# EAGLE design schematic (EAGLE 9.6.2)
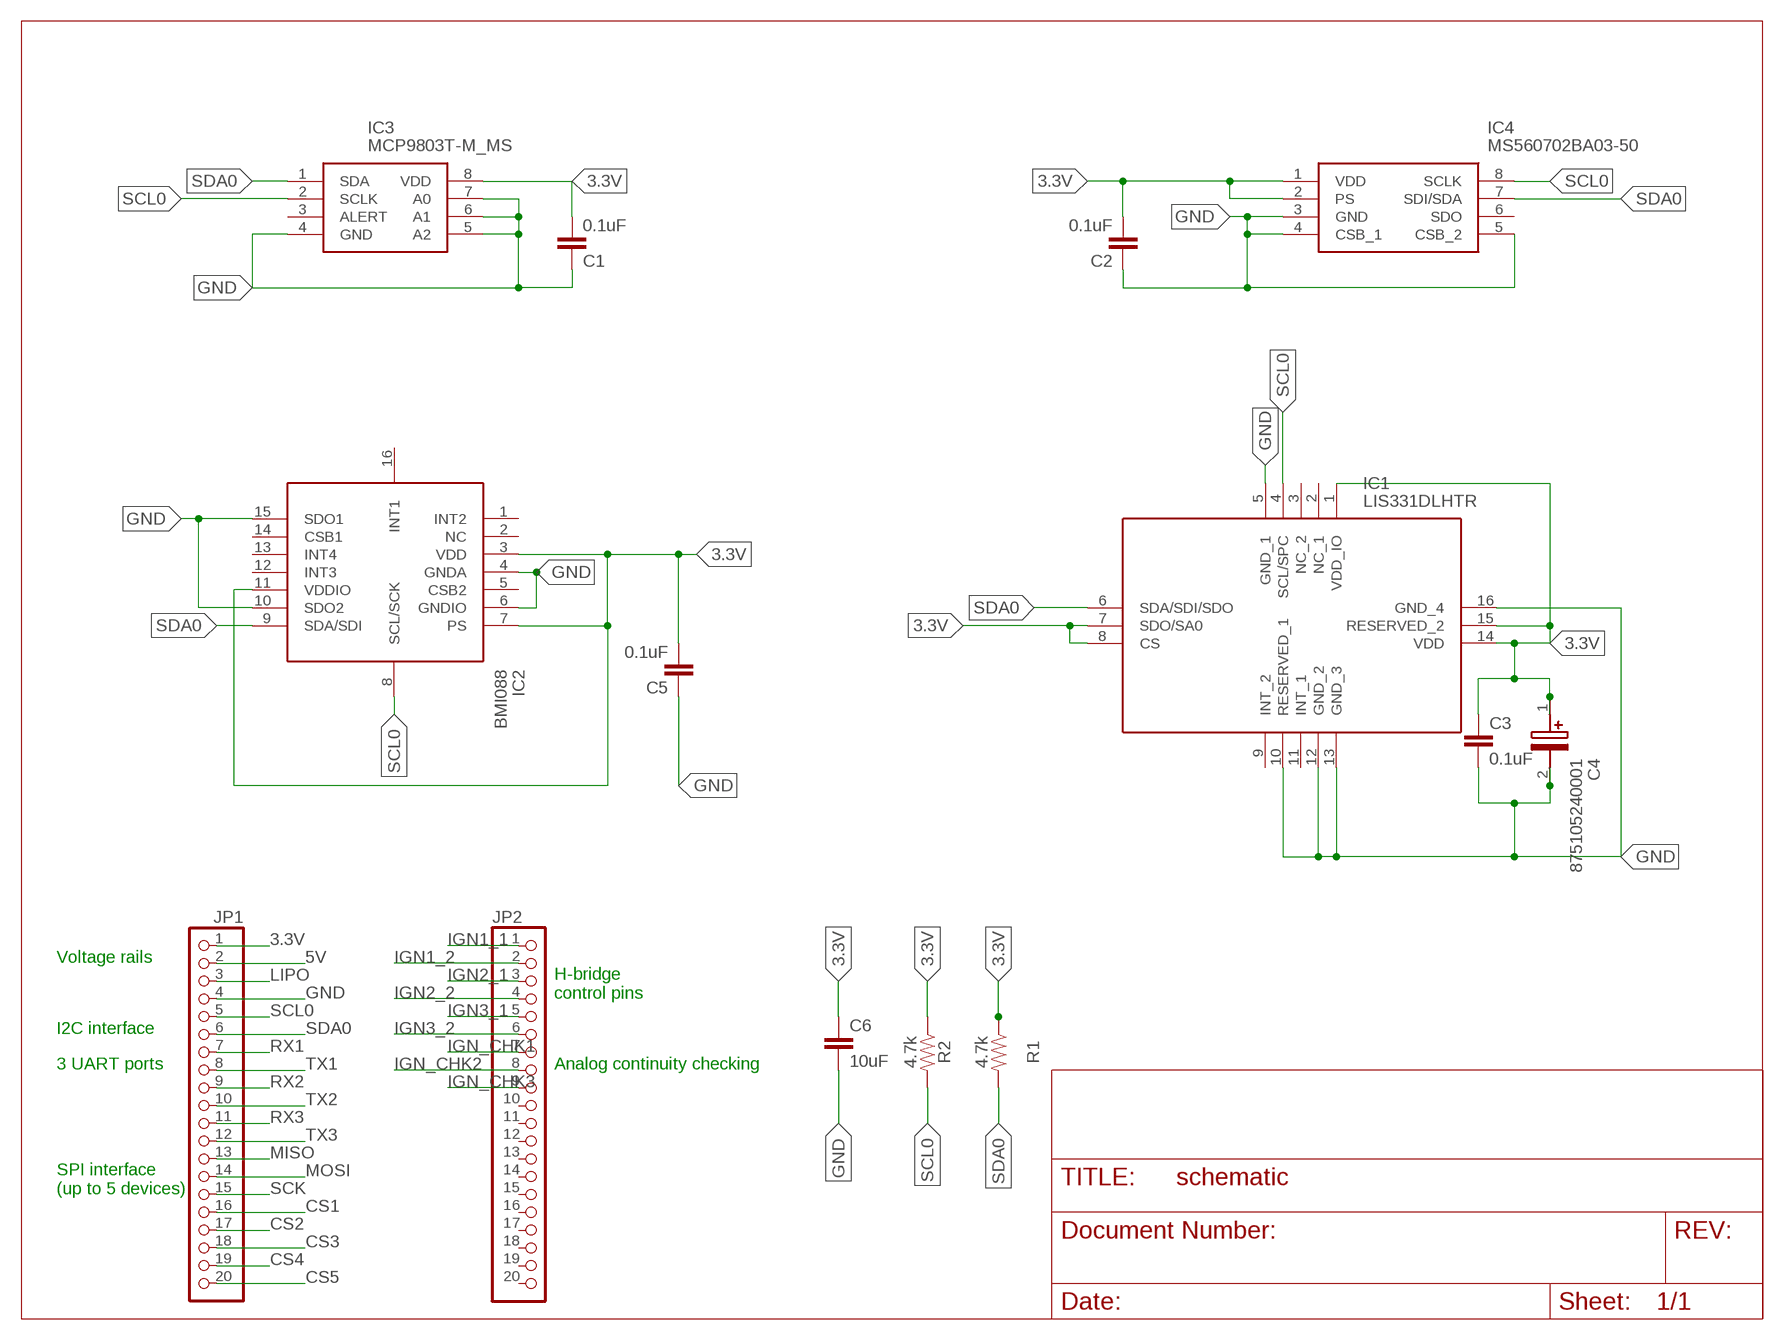
[diagram p0: schematic, sheet 1]

## Parts
C1  0.1uF  CAP-0805  [0805]
C2  0.1uF  CAP-0805  [0805]
C3  0.1uF  CAP-0805  [0805]
C4  875105240001  [CAPAE430X550N]
C5  0.1uF  CAP-0805  [0805]
C6  10uF  10UF-0805-10V-10%  [0805]
IC1  LIS331DLHTR  [LIS331DLHTR]
IC2  BMI088  [BMI088]
IC3  MCP9803T-M_MS  [SOP65P490X110-8N]
IC4  MS560702BA03-50  [MS5607-02BA03]
JP1  PINHD-1X20  [1X20]
JP2  PINHD-1X20  [1X20]
R1  4.7k  RESISTOR0805  [0805]
R2  4.7k  RESISTOR0805  [0805]

## Nets
3.3V: C1.2 C2.2 C3.2 C4.1(+) C5.2 C6.1 IC1.1(VDD_IO) IC1.7(SDO/SA0) IC1.8(CS) IC1.14(VDD) IC1.15(RESERVED_2) IC2.3(VDD) IC2.7(PS) IC2.11(VDDIO) IC3.8(VDD) IC4.1(VDD) IC4.2(PS) JP1.1 R1.1 R2.1
5V: JP1.2
CS1: JP1.16
CS2: JP1.17
CS3: JP1.18
CS4: JP1.19
CS5: JP1.20
GND: C1.1 C2.1 C3.1 C4.2(-) C5.1 C6.2 IC1.5(GND_1) IC1.10(RESERVED_1) IC1.12(GND_2) IC1.13(GND_3) IC1.16(GND_4) IC2.4(GNDA) IC2.6(GNDIO) IC2.10(SDO2) IC2.15(SDO1) IC3.4(GND) IC3.5(A2) IC3.6(A1) IC3.7(A0) IC4.3(GND) IC4.4(CSB_1) IC4.5(CSB_2) JP1.4
IGN1_1: JP2.1
IGN1_2: JP2.2
IGN2_1: JP2.3
IGN2_2: JP2.4
IGN3_1: JP2.5
IGN3_2: JP2.6
IGN_CHK1: JP2.7
IGN_CHK2: JP2.8
IGN_CHK3: JP2.9
LIPO: JP1.3
MISO: JP1.13
MOSI: JP1.14
RX1: JP1.7
RX2: JP1.9
RX3: JP1.11
SCK: JP1.15
SCL0: IC1.4(SCL/SPC) IC2.8(SCL/SCK) IC3.2(SCLK) IC4.8(SCLK) JP1.5 R2.2
SDA0: IC1.6(SDA/SDI/SDO) IC2.9(SDA/SDI) IC3.1(SDA) IC4.7(SDI/SDA) JP1.6 R1.2
TX1: JP1.8
TX2: JP1.10
TX3: JP1.12
Unconnected: IC1.2(NC_1) IC1.3(NC_2) IC1.9(INT_2) IC1.11(INT_1) IC2.1(INT2) IC2.2(NC) IC2.5(CSB2) IC2.12(INT3) IC2.13(INT4) IC2.14(CSB1) IC2.16(INT1) IC3.3(ALERT) IC4.6(SDO) JP2.10 JP2.11 JP2.12 JP2.13 JP2.14 JP2.15 JP2.16 JP2.17 JP2.18 JP2.19 JP2.20

## Notes on the sheet
- Voltage rails
- H-bridge
  control pins
- I2C interface
- 3 UART ports | Analog continuity checking
- SPI interface
  (up to 5 devices)

## Library data of the parts
C1-C3 C5 = SparkFun-Capacitors:CAP
C4 = 875105240001:875105240001: Wurth Elektronik 10uF 10 V dc Aluminium Polymer Capacitor, WCAP-PSLP Series 2000h 5.5 (Dia.) x 3.85mm Source: Datasheet <https://katalog.we-online.de/pbs/datasheet/875105240001.pdf>; DESCRIPTION: Wurth Elektronik 10uF 10 V dc Aluminium Polymer Capacitor, WCAP-PSLP Series 2000h 5.5 (Dia.) x 3.85mm; HEIGHT: 5.5mm; MANUFACTURER_NAME: Wurth Elektronik; MANUFACTURER_PART_NUMBER: 875105240001; MOUSER_PART_NUMBER: 710-875105240001; MOUSER_PRICE-STOCK: https://www.mouser.co.uk/ProductDetail/Wurth-Elektronik/875105240001?qs=0KOYDY2FL2%2FplCMEBEsJ%2FQ%3D%3D
C6 = SparkFun-Capacitors:10UF: 10.0µF ceramic capacitors A capacitor is a passive two-terminal electrical component used to store electrical energy temporarily in an electric field.; PROD_ID: CAP-11330
IC1 = LIS331DLHTR:LIS331DLHTR: Accelerometers DGTL OUTPT MTN SEN MEMS ULTRA LO PWR Source: Datasheet <https://media.digikey.com/pdf/Data Sheets/ST Microelectronics PDFS/LIS331DLH(TR).pdf>; ARROW_PART_NUMBER: LIS331DLHTR; ARROW_PRICE-STOCK: https://www.arrow.com/en/products/lis331dlhtr/stmicroelectronics; DESCRIPTION: Accelerometers DGTL OUTPT MTN SEN MEMS ULTRA LO PWR; HEIGHT: 1mm; MANUFACTURER_NAME: STMicroelectronics; MANUFACTURER_PART_NUMBER: LIS331DLHTR; MOUSER_PART_NUMBER: 511-LIS331DLHTR; MOUSER_PRICE-STOCK: https://www.mouser.co.uk/ProductDetail/STMicroelectronics/LIS331DLHTR?qs=5HwTSiuA5HAgV4AzJ7TrVQ%3D%3D
IC2 = BMI088:BMI088: Inertial Measurement Unit Digital Output 2.5V/3.3V Automotive Source: Datasheet <https://datasheet.datasheetarchive.com/originals/distributors/Datasheets_SAMA/994c3bf88e91a9e9fead6a819d348e4d.pdf>; ARROW_PART_NUMBER: BMI088; ARROW_PRICE-STOCK: https://www.arrow.com/en/products/bmi088/bosch?region=europe; DESCRIPTION: Inertial Measurement Unit Digital Output 2.5V/3.3V Automotive; HEIGHT: 1.45mm; MANUFACTURER_NAME: Bosch Sensortec; MANUFACTURER_PART_NUMBER: BMI088; MOUSER_PART_NUMBER: 262-BMI088; MOUSER_PRICE-STOCK: https://www.mouser.co.uk/ProductDetail/Bosch-Sensortec/BMI088?qs=f9yNj16SXrIMFspTV6RB6Q%3D%3D
IC3 = MCP9803T-M_MS:MCP9803T-M_MS: Temp Sensor Digital Serial (2-Wire, I2C, SMBus) Automotive 8-Pin MSOP T/R Source: Datasheet <https://www.arrow.com/en/products/mcp9803t-mms/microchip-technology>; ARROW_PART_NUMBER: MCP9803T-M/MS; ARROW_PRICE-STOCK: https://www.arrow.com/en/products/mcp9803t-mms/microchip-technology?region=nac; DESCRIPTION: Temp Sensor Digital Serial (2-Wire, I2C, SMBus) Automotive 8-Pin MSOP T/R; HEIGHT: 1.1mm; MANUFACTURER_NAME: Microchip; MANUFACTURER_PART_NUMBER: MCP9803T-M/MS; MOUSER_PART_NUMBER: 579-MCP9803T-M/MS; MOUSER_PRICE-STOCK: https://www.mouser.co.uk/ProductDetail/Microchip-Technology-Atmel/MCP9803T-M-MS?qs=QVBMgXxBiLy8E20114pHgA%3D%3D
IC4 = MS560702BA03-50:MS560702BA03-50: MS560702BA03-50, Barometric Pressure Sensor, 1200mbar 0 3.6 V Output, 8-Pin QFN Source: Datasheet <http://www.te.com/commerce/DocumentDelivery/DDEController?Action=srchrtrv&DocNm=MS5607-02BA03&DocType=Data Sheet&DocLang=English>; ARROW_PART_NUMBER: MS560702BA03-50; ARROW_PRICE-STOCK: https://www.arrow.com/en/products/ms560702ba03-50/te-connectivity?region=europe; DESCRIPTION: MS560702BA03-50, Barometric Pressure Sensor, 1200mbar 0 3.6 V Output, 8-Pin QFN; HEIGHT: mm; MANUFACTURER_NAME: TE Connectivity; MANUFACTURER_PART_NUMBER: MS560702BA03-50; MOUSER_PART_NUMBER: 824-MS560702BA03-50; MOUSER_PRICE-STOCK: https://www.mouser.co.uk/ProductDetail/Measurement-Specialties/MS560702BA03-50?qs=urSpXqmdEVImCZG1H%252BT8ng%3D%3D
JP1 JP2 = adafruit:PINHD-1X20: PIN HEADER
R1 R2 = SparkFun-Resistors:RESISTOR: Generic Resistor Package

## Board
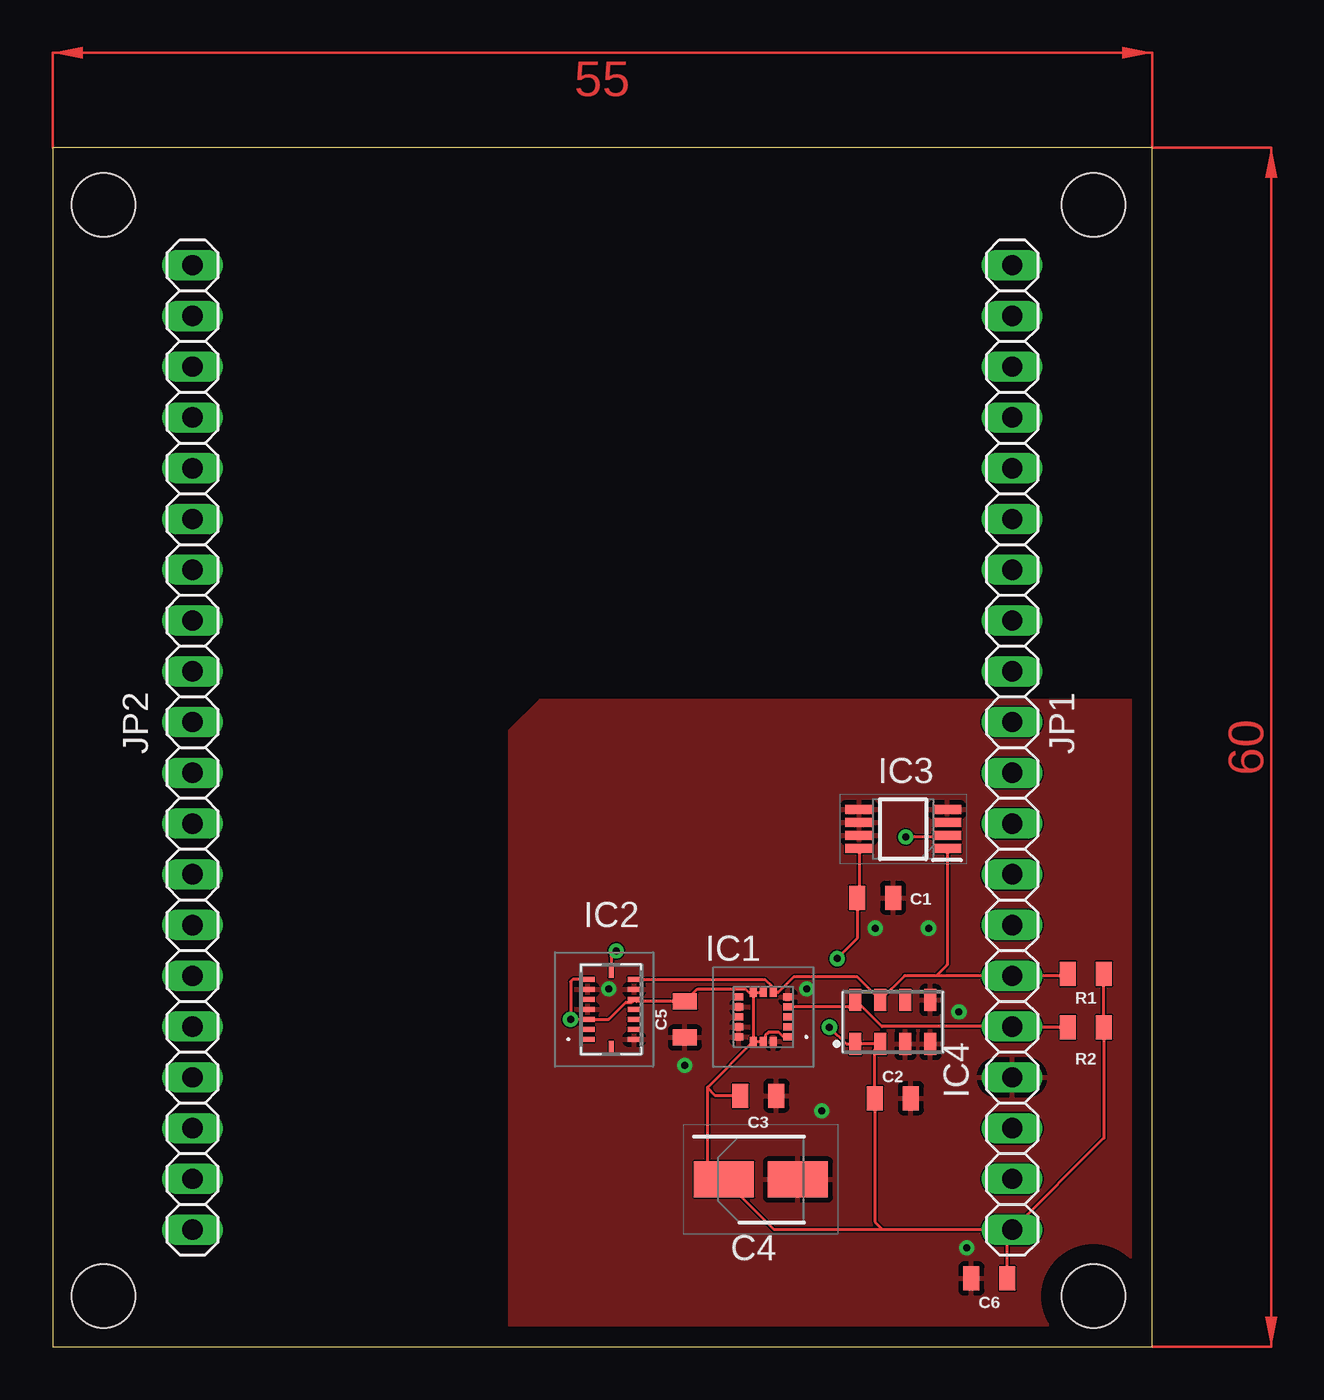
[diagram p1: board, top side]
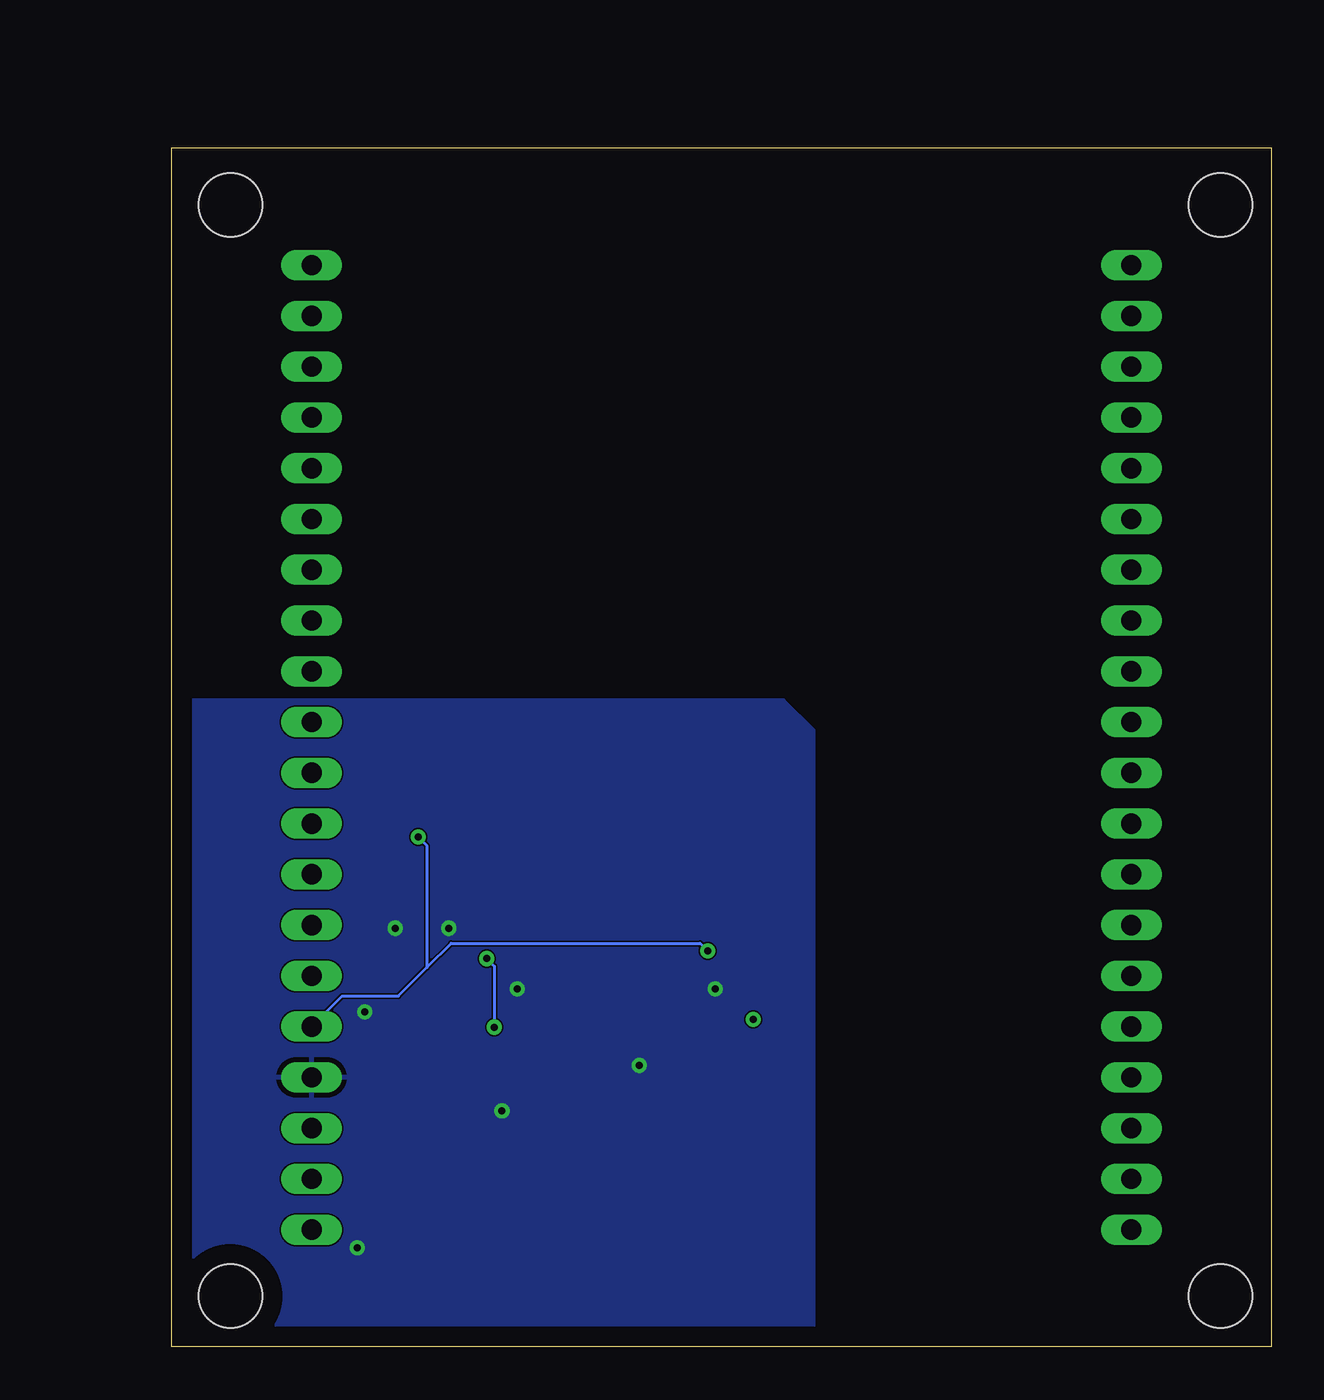
[diagram p2: board, bottom side, seen from below]

Size 55 x 60 mm. Coordinates in mm from the lower left corner, seen from the top.
Outline: 0,0 55,0 55,60 0,60 0,0
Copper layers (1*16): Top 0.035mm / dielectric 1.5mm / Bottom 0.035mm
Design rules "default *": minimum track width 6mil, minimum drill 0.35mm, track to track 3mil, track to pad 6mil, pad to pad 6mil, via to via 6mil, smd to smd 6mil, copper to edge 40mil, drill to drill 6mil, minimum pad ring 10mil, minimum via ring 8mil, stop-mask expansion 4mil, vias tented up to drill 0mil, thermal gap 10mil
Holes 3.17 mm at 2.54,2.54 52.07,2.54 52.07,57.15 2.54,57.15

### Footprints (pad centres in the part's own frame; a part is rotated, then mirrored left to right if it is on the bottom)
0805 = smd 0.8 x 1.2: 1 -0.9,0; 2 0.9,0
CAPAE430X550N = smd 3 x 1.8: 1 -1.85,0; 2 1.85,0
LIS331DLHTR = smd 0.45 x 0.35: 1 -1.225,1; 2 -1.225,0.5; 3 -1.225,0; 4 -1.225,-0.5; 5 -1.225,-1; 9 1.225,-1; 10 1.225,-0.5; 11 1.225,0; 12 1.225,0.5; 13 1.225,1 | smd 0.35 x 0.45: 6 -0.5,-1.225; 7 0,-1.225; 8 0.5,-1.225; 14 0.5,1.225; 15 0,1.225; 16 -0.5,1.225
BMI088 = smd 0.25 x 0.675: 1 -1.5,1.165; 2 -1,1.165; 3 -0.5,1.165; 4 0,1.165; 5 0.5,1.165; 6 1,1.165; 7 1.5,1.165; 9 1.5,-1.165; 10 1,-1.165; 11 0.5,-1.165; 12 0,-1.165; 13 -0.5,-1.165; 14 -1,-1.165; 15 -1.5,-1.165 | smd 0.675 x 0.25: 8 1.915,0; 16 -1.915,0
SOP65P490X110-8N = smd 1.4 x 0.45: 1 -2.2,0.975; 2 -2.2,0.325; 3 -2.2,-0.325; 4 -2.2,-0.975; 5 2.2,-0.975; 6 2.2,-0.325; 7 2.2,0.325; 8 2.2,0.975
MS5607-02BA03 = smd 1.1 x 0.6: 1 -1.1,1.875; 2 -1.1,0.625; 3 -1.1,-0.625; 4 -1.1,-1.875; 5 1.1,-1.875; 6 1.1,-0.625; 7 1.1,0.625; 8 1.1,1.875
1X20 = drill 1.016 long: 1 -24.13,0; 2 -21.59,0; 3 -19.05,0; 4 -16.51,0; 5 -13.97,0; 6 -11.43,0; 7 -8.89,0; 8 -6.35,0; 9 -3.81,0; 10 -1.27,0; 11 1.27,0; 12 3.81,0; 13 6.35,0; 14 8.89,0; 15 11.43,0; 16 13.97,0; 17 16.51,0; 18 19.05,0; 19 21.59,0; 20 24.13,0

### Placement (x,y rotation side)
C1  41.15,22.48 180 top
C2  42.04,12.45 180 top
C3  35.31,12.57 180 top
C4  35.43,8.38 0 top
C5  31.62,16.38 90 top
C6  46.86,3.43 180 top
IC1  35.56,16.51 180 top
IC2  27.94,16.89 90 top
IC3  42.55,25.91 180 top
IC4  42.04,16.26 90 top
JP1  48,30 90 top
JP2  7,30 90 top
R1  51.69,18.67 180 top
R2  51.69,16 180 top

### Tracks (layer width: path | path; a pad name or v marks a point on that pad's centre or on a via)
3.3V  (via drill 0.35)
  Top 0.152: JP1.1 41.53,5.87 | IC1.14 IC1.15 35.66,15.38 35.66,15.61 35.79,15.74 36.33,15.74 36.56,15.51 IC1.1 | IC1.8 IC1.14 | IC1.8 IC1.7 | IC2.7 26.01,18.39 25.91,18.29 v25.91,16.38 26.77,16.38 IC2.3 27.82,16.39 28.67,17.25 28.96,17.25 IC2.11 29.21,17.28 C5.2 32.25,17.91 34.66,17.91 34.83,17.73 IC1.8 | JP1.1 52.59,10.46 R2.1 R1.1 | 41.53,5.87 41.14,6.26 C2.2 41.14,14.88 IC4.2 IC4.1 39.71,15.16 v38.86,16 | 41.53,5.87 36.09,5.87 C4.1 32.77,9.2 32.77,12.95 | 32.77,12.95 32.77,12.99 IC1.14 | C6.1 47.76,5.63 JP1.1 | IC3.8 40.34,22.58 C1.2 40.25,20.44 v39.24,19.43 | C3.2 33.15,12.57 32.77,12.95
  Bottom 0.152: v39.24,19.43 38.86,19.05 v38.86,16
GND  (via drill 0.35)
  other vias: 27.81,17.91 37.72,17.91 38.48,11.81 41.15,20.95 43.81,20.95 31.62,14.1 45.72,4.95 45.34,16.76
  pour Top: 24.38,32.38 55.63,32.38 55.63,0.38 54.48,-0.76 23.62,-0.76 22.86,0 22.86,30.86
  pour Bottom: 24.38,32.38 55.63,32.38 55.63,0.38 54.48,-0.76 23.62,-0.76 22.86,0 22.86,30.86
SCL0  (via drill 0.35)
  Top 0.152: v28.19,19.81 27.94,19.56 IC2.8 | JP1.5 47.97,16 | R2.2 48.03,16 JP1.5 | JP1.5 41.49,16.03 IC4.8 39.82,17.01 IC1.4 | IC3.2 44.69,25.53 v42.67,25.53
  Bottom 0.152: JP1.5 46.48,17.55 43.67,17.55 42.23,18.99 | v28.19,19.81 28.57,20.19 41.03,20.19 42.23,18.99 | v42.67,25.53 42.23,25.09 42.23,18.99
SDA0
  Top 0.152: R1.2 50.69,18.57 JP1.6 44.2,18.57 | IC2.9 35.63,18.39 35.96,18.05 35.96,17.83 IC1.6 36.29,17.73 37.07,18.51 40.25,18.51 IC4.7 42.63,18.57 44.2,18.57 | IC3.1 44.74,19.12 44.2,18.57
(copper drawn outside any net)
  shapes: Top area x2